# EAGLE design untitled (EAGLE 7.6.0)
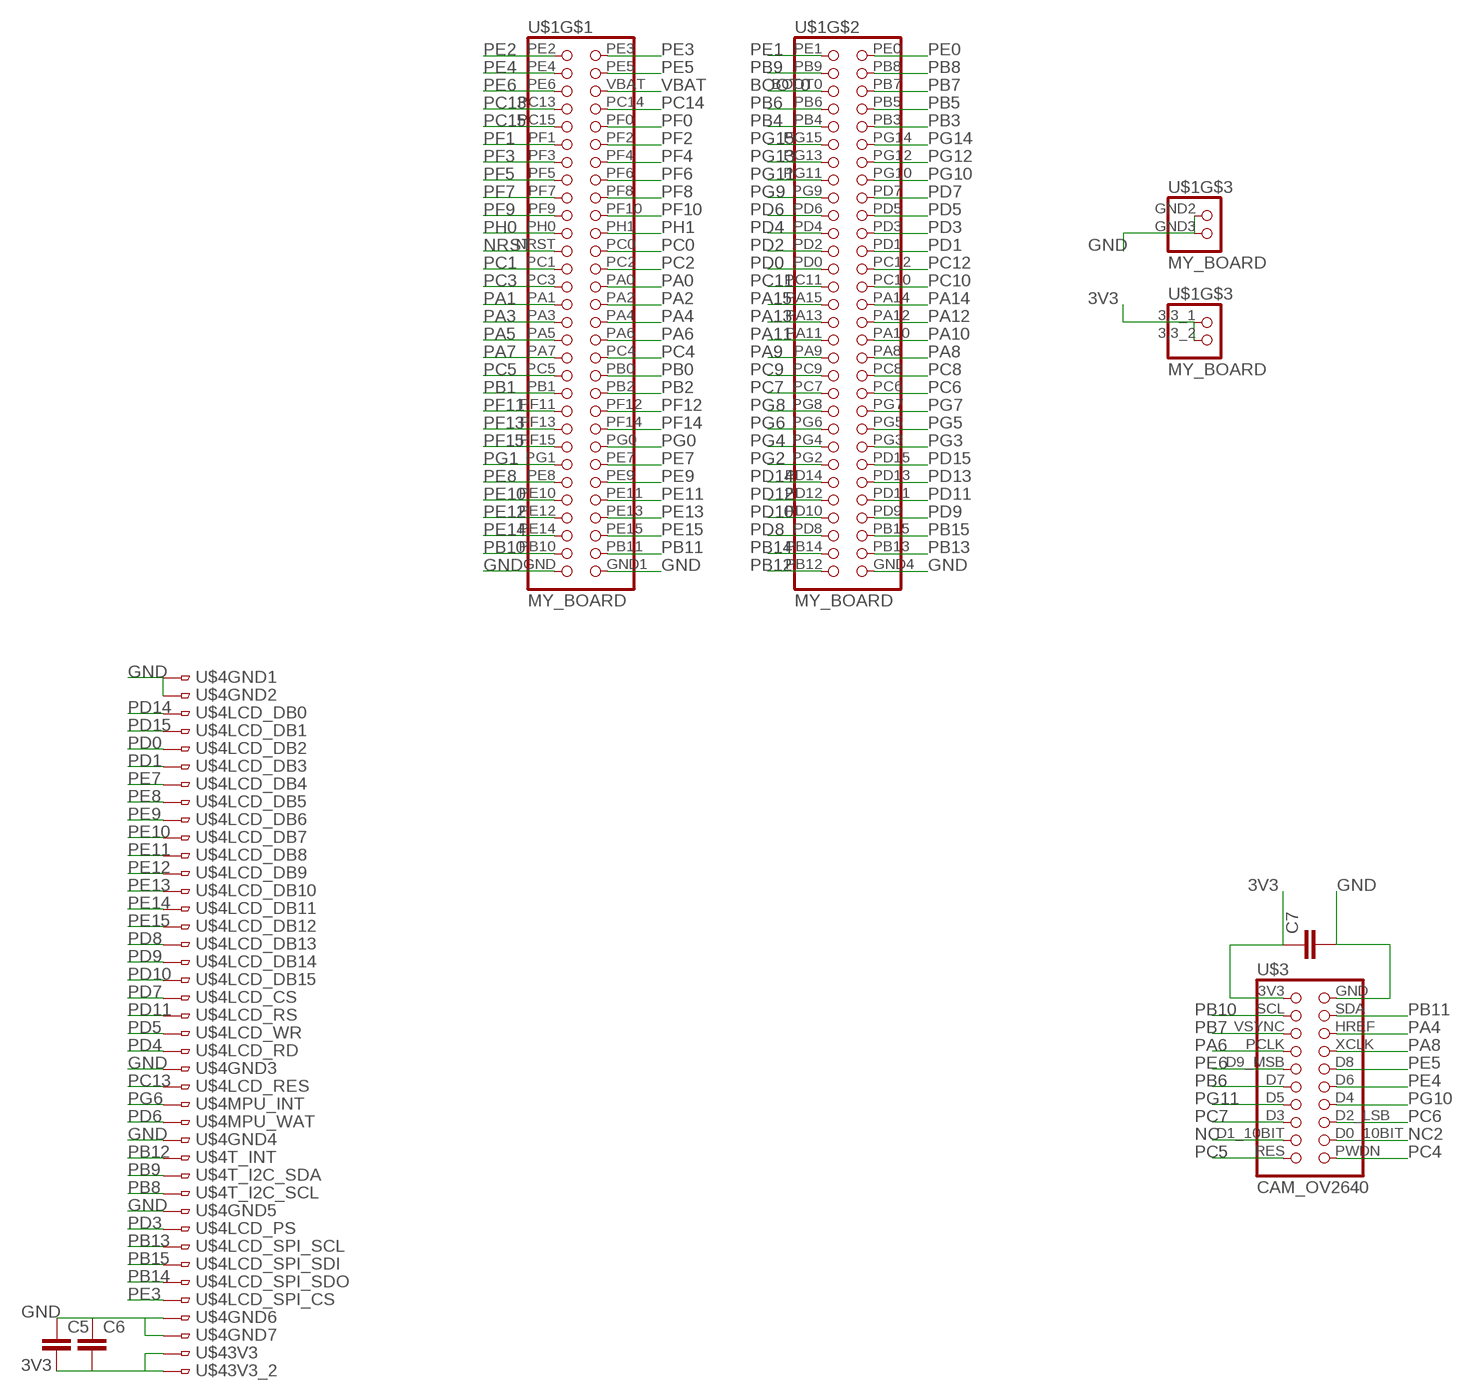
[diagram p0: schematic, sheet 1]

## Parts
C5  C-EUC1206  [C1206]
C6  C-EUC1206  [C1206]
C7  C-EUC1206  [C1206]
U$1  MY_BOARD  [MY_BOARD]
U$3  CAM_OV2640  [CAM_OV2640]
U$4  LCD800TFT  [FH12-40S-0.5SH]

## Nets
3V3: C5.2 C6.2 C7.1 U$1.3,3_1 U$1.3,3_2 U$3.3V3 U$4.39 U$4.40
BOOT0: U$1.BOOT0
GND: C5.1 C6.1 C7.2 U$1.GND U$1.GND1 U$1.GND2 U$1.GND3 U$1.GND4 U$3.GND U$4.1 U$4.2 U$4.23 U$4.27 U$4.31 U$4.37 U$4.38
NC: U$3.D1_10BIT
NC2: U$3.D0_10BIT
NRST: U$1.NRST
PA0: U$1.PA0
PA1: U$1.PA1
PA2: U$1.PA2
PA3: U$1.PA3
PA4: U$1.PA4 U$3.HREF
PA5: U$1.PA5
PA6: U$1.PA6 U$3.PCLK
PA7: U$1.PA7
PA8: U$1.PA8 U$3.XCLK
PA9: U$1.PA9
PA10: U$1.PA10
PA11: U$1.PA11
PA12: U$1.PA12
PA13: U$1.PA13
PA14: U$1.PA14
PA15: U$1.PA15
PB0: U$1.PB0
PB1: U$1.PB1
PB2: U$1.PB2
PB3: U$1.PB3
PB4: U$1.PB4
PB5: U$1.PB5
PB6: U$1.PB6 U$3.D7
PB7: U$1.PB7 U$3.VSYNC
PB8: U$1.PB8 U$4.30
PB9: U$1.PB9 U$4.29
PB10: U$1.PB10 U$3.SCL
PB11: U$1.PB11 U$3.SDA
PB12: U$1.PB12 U$4.28
PB13: U$1.PB13 U$4.33
PB14: U$1.PB14 U$4.35
PB15: U$1.PB15 U$4.34
PC0: U$1.PC0
PC1: U$1.PC1
PC2: U$1.PC2
PC3: U$1.PC3
PC4: U$1.PC4 U$3.PWDN
PC5: U$1.PC5 U$3.RES
PC6: U$1.PC6 U$3.D2_LSB
PC7: U$1.PC7 U$3.D3
PC8: U$1.PC8
PC9: U$1.PC9
PC10: U$1.PC10
PC11: U$1.PC11
PC12: U$1.PC12
PC13: U$1.PC13 U$4.24
PC14: U$1.PC14
PC15: U$1.PC15
PD0: U$1.PD0 U$4.5
PD1: U$1.PD1 U$4.6
PD2: U$1.PD2
PD3: U$1.PD3 U$4.32
PD4: U$1.PD4 U$4.22
PD5: U$1.PD5 U$4.21
PD6: U$1.PD6 U$4.26
PD7: U$1.PD7 U$4.19
PD8: U$1.PD8 U$4.16
PD9: U$1.PD9 U$4.17
PD10: U$1.PD10 U$4.18
PD11: U$1.PD11 U$4.20
PD12: U$1.PD12
PD13: U$1.PD13
PD14: U$1.PD14 U$4.3
PD15: U$1.PD15 U$4.4
PE0: U$1.PE0
PE1: U$1.PE1
PE2: U$1.PE2
PE3: U$1.PE3 U$4.36
PE4: U$1.PE4 U$3.D6
PE5: U$1.PE5 U$3.D8
PE6: U$1.PE6 U$3.D9_MSB
PE7: U$1.PE7 U$4.7
PE8: U$1.PE8 U$4.8
PE9: U$1.PE9 U$4.9
PE10: U$1.PE10 U$4.10
PE11: U$1.PE11 U$4.11
PE12: U$1.PE12 U$4.12
PE13: U$1.PE13 U$4.13
PE14: U$1.PE14 U$4.14
PE15: U$1.PE15 U$4.15
PF0: U$1.PF0
PF1: U$1.PF1
PF2: U$1.PF2
PF3: U$1.PF3
PF4: U$1.PF4
PF5: U$1.PF5
PF6: U$1.PF6
PF7: U$1.PF7
PF8: U$1.PF8
PF9: U$1.PF9
PF10: U$1.PF10
PF11: U$1.PF11
PF12: U$1.PF12
PF13: U$1.PF13
PF14: U$1.PF14
PF15: U$1.PF15
PG0: U$1.PG0
PG1: U$1.PG1
PG2: U$1.PG2
PG3: U$1.PG3
PG4: U$1.PG4
PG5: U$1.PG5
PG6: U$1.PG6 U$4.25
PG7: U$1.PG7
PG8: U$1.PG8
PG9: U$1.PG9
PG10: U$1.PG10 U$3.D4
PG11: U$1.PG11 U$3.D5
PG12: U$1.PG12
PG13: U$1.PG13
PG14: U$1.PG14
PG15: U$1.PG15
PH0: U$1.PH0
PH1: U$1.PH1
VBAT: U$1.VBAT

## Library data of the parts
C5-C7 = resistor:C-EU: CAPACITOR, European symbol
U$1 = Stworzone:MY_BOARD
U$3 = Stworzone:CAM_OV2640
U$4 = Stworzone:LCD800TFT

## Board
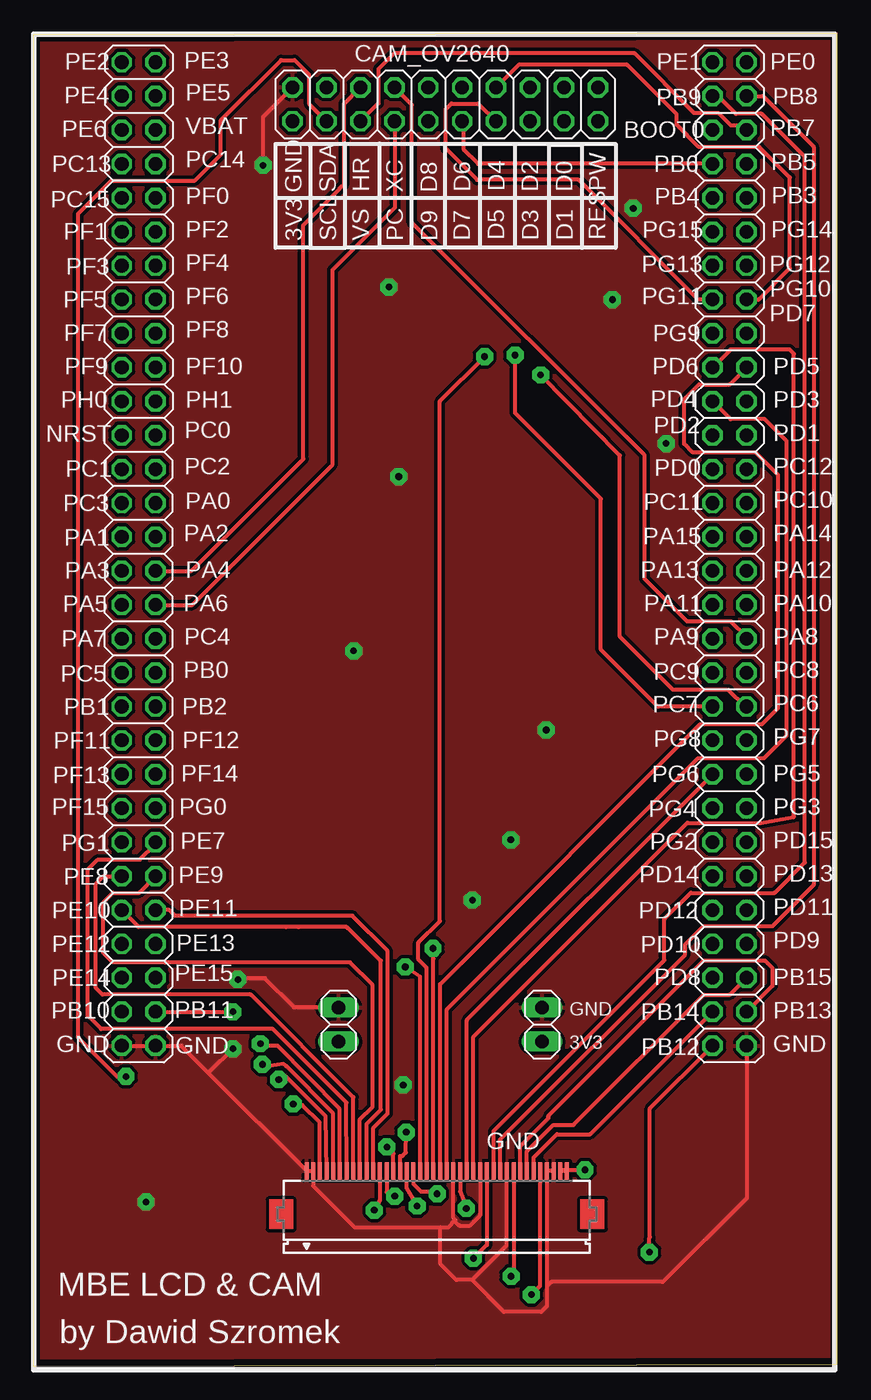
[diagram p1: board, top side]
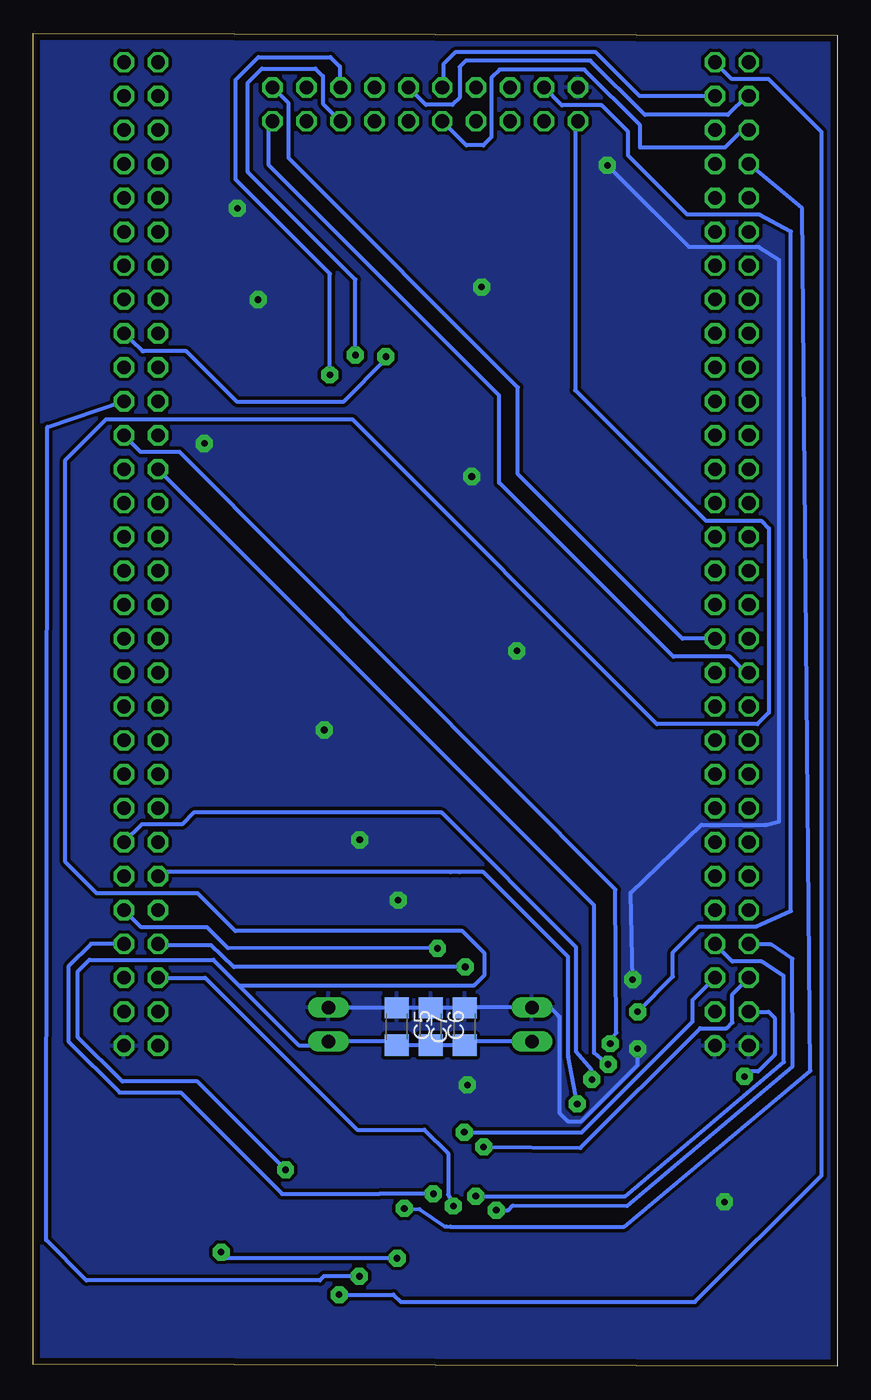
[diagram p2: board, bottom side, seen from below]

Size 60.18 x 99.82 mm. Coordinates in mm from the lower left corner, seen from the top.
Outline: 0,0 60.18,0.13 60.18,99.82 0,99.7 0,0
Copper layers (1*16): Top 0.035mm / dielectric 1.6mm / Bottom 0.035mm
Design rules "Elecrow_2-layer_PCB_eagle_rule": minimum track width 6mil, minimum drill 12mil, track to track 6mil, track to pad 6mil, pad to pad 6mil, via to via 8mil, smd to smd 0mil, copper to edge 20mil, drill to drill 10mil, minimum pad ring 6mil, minimum via ring 6mil, stop-mask expansion 0mil, vias tented up to drill 100mil, thermal gap 10mil

### Footprints (pad centres in the part's own frame; a part is rotated, then mirrored left to right if it is on the bottom)
C1206 = smd 1.6 x 1.8: 1 -1.4,0; 2 1.4,0
MY_BOARD = drill 1.016 long: 3,3_1 12.34,-5.43; 3,3_2 27.57,-5.43; GND2 12.34,-2.89; GND3 27.57,-2.89 | drill 1.016 octagon: BOOT0 40.34,62.84; GND -3.9,-5.74; GND1 -1.36,-5.74; GND4 42.88,-5.74; NRST -3.9,39.98; PA0 -1.36,34.9; PA1 -3.9,32.36; PA2 -1.36,32.36; PA3 -3.9,29.82; PA4 -1.36,29.82; PA5 -3.9,27.28; PA6 -1.36,27.28; PA7 -3.9,24.74; PA8 42.88,24.74; PA9 40.34,24.74; PA10 42.88,27.28; PA11 40.34,27.28; PA12 42.88,29.82; PA13 40.34,29.82; PA14 42.88,32.36; PA15 40.34,32.36; PB0 -1.36,22.2; PB1 -3.9,19.66; PB2 -1.36,19.66; PB3 42.88,57.76; PB4 40.34,57.76; PB5 42.88,60.3; PB6 40.34,60.3; PB7 42.88,62.84; PB8 42.88,65.38; PB9 40.34,65.38; PB10 -3.9,-3.2; PB11 -1.36,-3.2; PB12 40.34,-5.74; PB13 42.88,-3.2; PB14 40.34,-3.2; PB15 42.88,-0.66; PC0 -1.36,39.98; PC1 -3.9,37.44; PC2 -1.36,37.44; PC3 -3.9,34.9; PC4 -1.36,24.74; PC5 -3.9,22.2; PC6 42.88,19.66; PC7 40.34,19.66; PC8 42.88,22.2; PC9 40.34,22.2; PC10 42.88,34.9; PC11 40.34,34.9; PC12 42.88,37.44; PC13 -3.9,60.3; PC14 -1.36,60.3; PC15 -3.9,57.76; PD0 40.34,37.44; PD1 42.88,39.98; PD2 40.34,39.98; PD3 42.88,42.52; PD4 40.34,42.52; PD5 42.88,45.06; PD6 40.34,45.06; PD7 42.88,47.6; PD8 40.34,-0.66; PD9 42.88,1.88; PD10 40.34,1.88; PD11 42.88,4.42; PD12 40.34,4.42; PD13 42.88,6.96; PD14 40.34,6.96; PD15 42.88,9.5; PE0 42.88,67.92; PE1 40.34,67.92; PE2 -3.9,67.92; PE3 -1.36,67.92; PE4 -3.9,65.38; PE5 -1.36,65.38; PE6 -3.9,62.84; PE7 -1.36,9.5; PE8 -3.9,6.96; PE9 -1.36,6.96; PE10 -3.9,4.42; PE11 -1.36,4.42; PE12 -3.9,1.88; PE13 -1.36,1.88; PE14 -3.9,-0.66; PE15 -1.36,-0.66; PF0 -1.36,57.76; PF1 -3.9,55.22; PF2 -1.36,55.22; PF3 -3.9,52.68; PF4 -1.36,52.68; PF5 -3.9,50.14; PF6 -1.36,50.14; PF7 -3.9,47.6; PF8 -1.36,47.6; PF9 -3.9,45.06; PF10 -1.36,45.06; PF11 -3.9,17.12; PF12 -1.36,17.12; PF13 -3.9,14.58; PF14 -1.36,14.58; PF15 -3.9,12.04; PG0 -1.36,12.04; PG1 -3.9,9.5; PG2 40.34,9.5; PG3 42.88,12.04; PG4 40.34,12.04; PG5 42.88,14.58; PG6 40.34,14.58; PG7 42.88,17.12; PG8 40.34,17.12; PG9 40.34,47.6; PG10 42.88,50.14; PG11 40.34,50.14; PG12 42.88,52.68; PG13 40.34,52.68; PG14 42.88,55.22; PG15 40.34,55.22; PH0 -3.9,42.52; PH1 -1.36,42.52; VBAT -1.36,62.84
CAM_OV2640 = drill 1.016 octagon: 3V3 -1.27,11.43; D0_10BIT 1.27,-8.89; D1_10BIT -1.27,-8.89; D2_LSB 1.27,-6.35; D3 -1.27,-6.35; D4 1.27,-3.81; D5 -1.27,-3.81; D6 1.27,-1.27; D7 -1.27,-1.27; D8 1.27,1.27; D9_MSB -1.27,1.27; GND 1.27,11.43; HREF 1.27,6.35; PCLK -1.27,3.81; PWDN 1.27,-11.43; RES -1.27,-11.43; SCL -1.27,8.89; SDA 1.27,8.89; VSYNC -1.27,6.35; XCLK 1.27,3.81
FH12-40S-0.5SH = smd 0.3 x 1.3: 1 -9.75,3.25; 2 -9.25,3.25; 3 -8.75,3.25; 4 -8.25,3.25; 5 -7.75,3.25; 6 -7.25,3.25; 7 -6.75,3.25; 8 -6.25,3.25; 9 -5.75,3.25; 10 -5.25,3.25; 11 -4.75,3.25; 12 -4.25,3.25; 13 -3.75,3.25; 14 -3.25,3.25; 15 -2.75,3.25; 16 -2.25,3.25; 17 -1.75,3.25; 18 -1.25,3.25; 19 -0.75,3.25; 20 -0.25,3.25; 21 0.25,3.25; 22 0.75,3.25; 23 1.25,3.25; 24 1.75,3.25; 25 2.25,3.25; 26 2.75,3.25; 27 3.25,3.25; 28 3.75,3.25; 29 4.25,3.25; 30 4.75,3.25; 31 5.25,3.25; 32 5.75,3.25; 33 6.25,3.25; 34 6.75,3.25; 35 7.25,3.25; 36 7.75,3.25; 37 8.25,3.25; 38 8.75,3.25; 39 9.25,3.25; 40 9.75,3.25

### Placement (x,y rotation side)
C5  32.98,25.43 270 bottom
C6  30.44,25.43 270 bottom
C7  27.9,25.43 90 bottom
U$1  10.52,29.74 0 top
U$3  30.84,94.51 90 top
U$4  30.2,11.38 0 top

### Tracks (layer width: path | path; a pad name or v marks a point on that pad's centre or on a via)
3V3  (via drill 0.5 pad 1.27)
  Top 0.305: U$4.40 U$4.39 39.53,14.71 v41.3,14.71
  Bottom 0.305: v41.3,14.71 47.9,21.31 53.52,21.31 56.85,24.64 56.85,29.57 55.98,30.43 46.71,30.43 44.81,28.52 | 44.81,28.52 40.31,24.03 38.37,24.03 U$1.3,3_2 33.26,24.31 C5.2 C6.2 C7.1 27.62,24.31 U$1.3,3_1 | 44.81,28.52 27.18,28.52 26.39,29.31 26.39,30.91 28.07,32.59 45.06,32.59 47.88,35.41 55.45,35.41 57.78,37.74 57.78,67.87 54.74,70.92 36.32,70.92 13.49,48.08 5.97,48.08 5.11,48.95 5.11,62.74 5.69,63.32 9.83,63.32 19.61,73.1 19.61,93.04 U$3.3V3
GND  (via drill 0.5 pad 1.27)
  Top 0.305: U$1.GND U$1.GND1 11.08,24 13.15,21.93 | 13.15,21.93 U$4.1 U$4.2 20.95,13.52 24.05,10.41 30.48,10.41 | U$4.38 U$4.37 38.45,5.97 | U$4.31 35.43,14.61 35.43,9.04 32.84,6.45 | 33.45,11.4 U$4.27 33.45,11.28 32.69,10.52 31.9,10.52 31.6,10.82 31.6,10.95 | 31.6,10.95 31.45,11.09 U$4.23 | v14.94,23.77 13.15,21.98 13.15,21.93 | 30.48,10.41 31.06,10.41 31.6,10.95 | 32.84,6.45 31.67,6.45 30.48,7.65 30.48,10.41 | 38.45,5.97 38.45,4.49 38.02,4.06 35.23,4.06 32.84,6.45 | U$1.GND4 53.4,12.58 47.12,6.3 38.78,6.3 38.45,5.97 | v15.32,28.96 15.19,29.06 17.32,29.06 19.53,26.85 U$1.GND2 | v17.2,89.94 17.2,93.57 U$3.GND
  Bottom 0.305: 32.46,26.83 C6.1 C7.2 27.88,26.85 U$1.GND2 21.47,26.85 20.88,26.26 | 32.46,26.83 C5.1 | U$1.GND3 32.48,26.85 32.46,26.83 | 20.9,26.26 20.88,26.26 | 20.88,26.26 20.8,26.19 20.8,18.97 20.17,18.34 19.15,18.34 14.94,22.56 v14.94,23.77 | v15.32,28.96 15.47,35.46 10.16,40.54 5.36,40.54 4.34,40.79 4.34,82.85 5.87,83.82 11.07,83.82 v17.2,89.94
  other vias: 27.69,21.06 47.37,69.11 38.4,47.65 43.36,79.88 44.91,86.72 8.43,12.29 23.98,53.57 26.62,80.82 35.74,39.42 27.36,66.62 32.87,34.9
  pour Bottom (isolate 0.254): 0.05,99.72 60.1,99.72 60.1,0.13 0.05,0.13
  pour Top (isolate 0.254): 0.03,99.72 60.1,99.72 60.1,0.13 0.03,0.13
PA4
  Top 0.305: U$1.PA4 11.84,59.56 20.22,67.95 20.22,85.47 22.94,88.19 22.94,88.21 23.06,88.34 23.09,88.34 23.27,88.52 23.27,94.56 U$3.HREF
PA6
  Top 0.305: U$1.PA6 11.89,57.02 22.4,67.54 22.4,82.12 27.08,86.79 27.08,93.19 U$3.PCLK
PA8
  Top 0.305: U$1.PA8 53.4,54.61 52.22,55.78 48.95,55.78 45.77,58.95 45.77,68.22 28.35,85.65 28.35,94.46 U$3.XCLK
PB6
  Top 0.305: U$1.PB6 33.3,90.04 32.23,91.11 32.23,93.12 U$3.D7
PB7
  Top 0.305: 53.4,92.6 U$1.PB7 53.04,92.94 52.22,92.94 51.28,93.88 49.45,93.88 45.01,98.32 27,98.32 25.83,97.16 25.83,94.59 U$3.VSYNC
PB8
  Top 0.305: U$4.30 34.95,16.97 48.79,30.81 48.79,31.57 50.16,32.94 55.32,32.94 58.42,36.04 58.42,91.34 54.63,95.12 U$1.PB8
PB9
  Top 0.305: U$4.29 34.45,17.61 47.24,30.4 47.24,33.48 49.23,35.46 55.5,35.46 57.76,37.72 57.76,90.58 54.53,93.8 52.6,93.8 51.28,95.12 U$1.PB9
PB10  (via drill 0.5 pad 1.27)
  Top 0.305: v6.93,21.69 6.25,21.69 3.35,24.59 3.35,86.31 5.84,88.8 12.09,88.8 14.05,90.75 14.05,93.32 18.54,97.82 19.56,97.82 20.62,96.75 20.62,94.56 U$3.SCL
  Bottom 0.305: U$1.PB10 5.13,26.54 4.67,26.09 4.67,23.32 5.92,22.07 6.55,22.07 v6.93,21.69
PB11  (via drill 0.5 pad 1.27)
  Top 0.305: U$1.PB11 12.19,26.54 v14.94,26.54
  Bottom 0.305: v14.94,26.54 12.29,29.18 12.29,30.99 10.36,32.92 6.07,32.92 3.45,34.09 3.45,84.99 5.82,86.26 11.23,86.26 15.65,90.68 15.65,92.46 17.63,94.44 20.6,94.44 U$3.SDA
PB12  (via drill 0.5 pad 1.27)
  Top 0.305: U$1.PB12 46.15,19.3 46.15,9.65 46.13,9.63 v46.13,8.53 | U$4.28 33.95,9.08 v32.94,8.08
  Bottom 0.305: v32.94,8.08 45.67,8.08 v46.13,8.53
PB13
  Top 0.305: U$4.33 36.45,16.46 38.56,18.57 38.56,18.75 50.19,30.38 54.76,30.38 55.32,29.82 55.32,28.47 U$1.PB13
PB14
  Top 0.305: U$4.35 37.45,15.63 39.19,17.37 41.69,17.37 U$1.PB14
PB15
  Top 0.305: U$4.34 36.95,16.07 38.94,18.06 40.44,18.06 50.19,27.81 52.13,27.81 U$1.PB15
PC4
  Bottom 0.305: U$1.PC4 11.58,54.48 23.9,66.8 23.9,73.3 41.07,90.47 41.07,94.59 U$3.PWDN
PC5
  Bottom 0.305: U$1.PC5 6.86,51.94 8.05,53.14 12.27,53.14 25.3,66.17 25.3,72.69 42.54,89.94 42.54,92.96 U$3.RES
PC6  (via drill 0.5 pad 1.27)
  Top 0.305: U$1.PC6 53.29,49.4 52.04,50.65 47.9,50.65 43.92,54.64 43.92,68.2 v37.97,74.24
  Bottom 0.305: v37.97,74.24 37.97,81.81 45.03,88.87 45.03,96.34 43.33,98.04 37.95,98.04 37.24,97.33 37.24,95.83 U$3.D2_LSB
PC7  (via drill 0.5 pad 1.27)
  Top 0.305: U$1.PC7 46.76,49.4 42.49,53.67 42.49,64.97 36.07,71.4 v36.07,75.72
  Bottom 0.305: v36.07,75.72 36.07,81.38 44.12,89.43 44.12,96.14 43.08,97.18 39.07,97.18 38.51,96.62 38.51,94.56 U$3.D3
PC13  (via drill 0.5 pad 1.27)
  Top 0.305: U$4.24 31.95,13.08 v32.41,11.81
  Bottom 0.305: v32.41,11.81 31.27,11.76 29.36,10.46 29.24,10.46 28.96,10.44 15.93,10.44 2.01,22.12 2.62,86.73 U$1.PC13
PD0  (via drill 0.5 pad 1.27)
  Top 0.305: v17.14,22.61 17.45,22.89 17.07,22.61 17.73,22.48 18.72,22.63 18.92,22.48 22.45,18.93 U$4.5
  Bottom 0.305: v17.14,22.61 17.14,22.58 18.19,23.44 18.19,34.51 U$1.PD0
PD1  (via drill 0.5 pad 1.27)
  Top 0.305: U$4.6 22.93,19.26 18.29,24 17.25,24 v16.99,24.16
  Bottom 0.305: v16.99,24.16 16.99,24.33 16.54,24.97 16.61,35.69 49.23,68.48 52.15,68.48 U$1.PD1
PD3  (via drill 0.5 pad 1.27)
  Top 0.305: U$4.32 35.95,6.92 v35.76,6.73
  Bottom 0.305: v35.76,6.73 38.43,6.73 38.73,6.43 56.21,6.43 59.23,9.45 59.13,70.34 U$1.PD3
PD4
  Top 0.305: U$4.22 30.95,26.71 49.78,45.54 54.71,45.54 56.39,47.22 56.39,69.29 54.76,70.92 52.2,70.92 U$1.PD4
PD5
  Top 0.305: U$4.21 30.45,28.6 49.94,48.08 54.56,48.08 55.75,49.28 55.75,66.75 54.08,68.43 49.38,68.43 48.72,69.09 48.72,72.42 49.83,73.53 52.13,73.53 U$1.PD5
PD6
  Top 0.305: U$4.26 32.95,24.67 48.97,40.69 54.46,40.69 56.95,41.15 56.95,75.82 56.62,76.15 52.2,76.15 U$1.PD6
PD7  (via drill 0.5 pad 1.27)
  Top 0.305: U$4.19 29.45,29.83 28.83,30.45 28.83,31.72 30.43,33.32 30.43,72.26 v33.78,75.62
  Bottom 0.305: 51.95,76 52.23,76.26 | 52.23,76.26 U$1.PD7 | v33.78,75.62 33.78,75.41 36.98,72.21 44.91,72.21 48.72,76.02 51.99,76.02 52.23,76.26
PD8  (via drill 0.5 pad 1.27)
  Top 0.305: v28.73,11.99 27.95,13.32 U$4.16
  Bottom 0.305: U$1.PD8 47.32,29.08 35.94,17.7 30.91,17.7 29.13,15.93 29.13,12.85 v28.73,11.99
PD9  (via drill 0.5 pad 1.27)
  Top 0.305: U$4.17 28.45,13.64 29.01,13.08 30.2,13.08 v30.23,12.9
  Bottom 0.305: U$1.PD9 55.85,31.62 57.56,29.92 57.56,24.33 53.72,20.5 49.15,20.5 41.55,12.9 34.29,12.9 v30.23,12.9
PD10  (via drill 0.5 pad 1.27)
  Top 0.305: U$4.18 28.95,29.16 v27.84,29.9
  Bottom 0.305: v27.84,29.9 45.16,29.9 46.86,31.52 50.75,31.52 U$1.PD10
PD11  (via drill 0.5 pad 1.27)
  Top 0.305: U$4.20 29.95,30.53 v29.92,31.29
  Bottom 0.305: v29.92,31.29 45.62,31.32 47.17,32.87 52.1,32.87 U$1.PD11
PD14  (via drill 0.5 pad 1.27)
  Top 0.305: U$4.3 21.43,18.02 21.43,18.25 20.14,19.53 v19.46,19.63
  Bottom 0.305: v19.46,19.63 20.12,23.22 20.14,23.65 20.14,30.66 26.49,37.01 28.27,37.01 28.93,37.01 50.55,37.01 U$1.PD14
PD15  (via drill 0.5 pad 1.27)
  Top 0.305: U$4.4 21.87,18.71 18.82,21.77 18.49,21.56 v18.36,21.46
  Bottom 0.305: v18.36,21.46 18.39,22.17 19.53,23.55 19.53,31.37 29.62,41.45 48.18,41.45 49.05,40.59 52.05,40.59 U$1.PD15
PE3  (via drill 0.5 pad 1.27)
  Top 0.305: U$4.36 37.93,12.88 37.93,6 v37.29,5.36
  Bottom 0.305: U$1.PE3 7.89,96.39 5.13,96.39 1.17,92.43 1.17,14.27 10.64,4.8 32.66,4.8 33.22,5.36 v37.29,5.36
PE4
  Bottom 0.305: U$1.PE4 6.78,95.12 8.18,93.73 14.4,93.73 18.47,97.79 27.79,97.79 28.27,97.31 28.27,95 28.8,94.46 30.78,94.46 U$3.D6
PE5
  Bottom 0.305: U$3.D8 29.49,95.86 29.49,97.51 28.6,98.4 18.06,98.4 14.78,95.12 U$1.PE5
PE6
  Bottom 0.305: U$1.PE6 7.09,92.58 8.41,91.26 14.76,91.26 14.76,92.94 18.92,97.1 25.27,97.1 25.88,96.49 25.88,92.05 26.49,91.44 27.76,91.44 U$3.D9_MSB
PE7
  Top 0.305: U$1.PE7 9.16,39.13 7.98,37.95 4.83,37.95 4.06,37.19 4.06,26.26 5.08,25.25 17.93,25.25 23.43,19.75 U$4.7
PE8
  Top 0.305: U$1.PE8 6.59,36.68 5.23,36.68 4.67,36.12 4.67,28.32 5.16,27.84 16.26,27.84 23.95,20.14 U$4.8
PE9
  Top 0.305: 9.83,30.25 5.94,30.25 5.23,30.96 5.23,34.75 5.94,35.46 7.91,35.46 U$1.PE9 | 9.86,30.23 9.83,30.25 | U$4.9 24.45,18.48 25.4,19.43 25.4,28.55 23.7,30.25 9.83,30.25
PE10
  Top 0.305: U$1.PE10 7.89,32.89 18.92,32.89 19.84,32.89 23.44,32.89 23.52,32.82 23.55,32.82 26.01,30.35 26.01,19.2 24.95,18.14 U$4.10
PE11
  Top 0.305: U$1.PE11 10.19,34.16 10.62,33.73 23.88,33.73 26.52,31.09 26.52,18.92 25.45,17.86 U$4.11 | U$1.PE11
PE12  (via drill 0.5 pad 1.27)
  Top 0.305: U$4.12 25.95,12.41 v25.53,11.68
  Bottom 0.305: v25.53,11.68 24.64,11.68 24.28,12.04 15.72,11.99 3.33,22.45 3.35,30.51 4.93,31.57 6.56,31.57 U$1.PE12
PE13  (via drill 0.5 pad 1.27)
  Top 0.305: U$4.13 26.45,13.02 v27.05,12.73
  Bottom 0.305: v27.05,12.73 15.87,12.73 3.99,22.78 4.01,29.24 5.64,30.3 7.83,30.3 U$1.PE13
PE14  (via drill 0.5 pad 1.27)
  Top 0.305: U$4.14 26.95,15.92 v26.47,16.41
  Bottom 0.305: v26.47,16.41 19.23,16.33 10.26,25.3 8.28,25.3 7.85,25.73 7.85,27.85 U$1.PE14
PE15  (via drill 0.5 pad 1.27)
  Top 0.305: U$4.15 27.45,15.74 27.63,15.74 27.89,16 v27.91,17.53
  Bottom 0.305: v27.91,17.53 27.94,17.5 19.13,17.5 10.82,25.81 10.82,27.42 U$1.PE15
PG6
  Top 0.305: U$4.25 32.45,25.92 U$1.PG6
PG10
  Top 0.305: U$1.PG10 54.31,79.88 56.64,82.22 56.64,89.03 54.36,91.31 49.83,91.31 48.16,92.99 48.16,93.75 44.45,97.46 36.32,97.46 U$3.D4
PG11
  Top 0.305: U$1.PG11 49.78,79.88 40.82,88.85 33.22,88.85 30.86,91.21 30.86,94.13 31.29,94.56 33.32,94.56 U$3.D5

### Text on the board
tNames: PE2 | PE3 | CAM_OV2640 | PE1 | PE0 | PE4 | PE5 | PB9 | PB8 | PE6 | VBAT | BOOT0 | PB7 | PC13 | PC14 | PB6 | PB5 | GND | SDA | HR | XC | D8 | D6 | D4 | D2 | D0 | PW | PF0 | PB4 | PB3 | PC15 | PF1 | PF2 | 3V3 | SCL | VS | PC | D9 | D7 | D5 | D3 | D1 | RES | PG15 | PG14 | PF4 | PG13 | PG12 | PF3 | PG10 | PF5 | PF6 | PG11 | PD7 | PF8 | PF7 | PG9 | PF9 | PF10 | PD6 | PD5 | PD4 | PH0 | PH1 | PD3 | PD2 | NRST | PC0 | PD1 | PC1 | PC2 | PD0 | PC12 | PC3 | PA0 | PC11 | PC10 | PA1 | PA2 | PA15 | PA14 | PA3 | PA4 | PA13 | PA12 | PA5 | PA6 | PA11 | PA10 | PA7 | PC4 | PA9 | PA8 | PC5 | PB0 | PC9 | PC8 | PB2 | PC7 | PC6 | PB1 | PF11 | PF12 | PG8 | PG7 | PF13 | PF14 | PG6 | PG5 | PF15 | PG0 | PG4 | PG3 | PG1 | PE7 | PG2 | PD15 | PE8 | PE9 | PD14 | PD13 | PE10 | PE11 | PD12 | PD11 | PE12 | PE13 | PD10 | PD9 | PE15 | PE14 | PD8 | PB15 | PB10 | PB11 | GND | PB14 | PB13 | GND | GND | 3V3 | PB12 | GND | GND | MBE LCD & CAM | by Dawid Szromek